# EAGLE design Stepper_driver_1_0 (EAGLE 6.6.0)
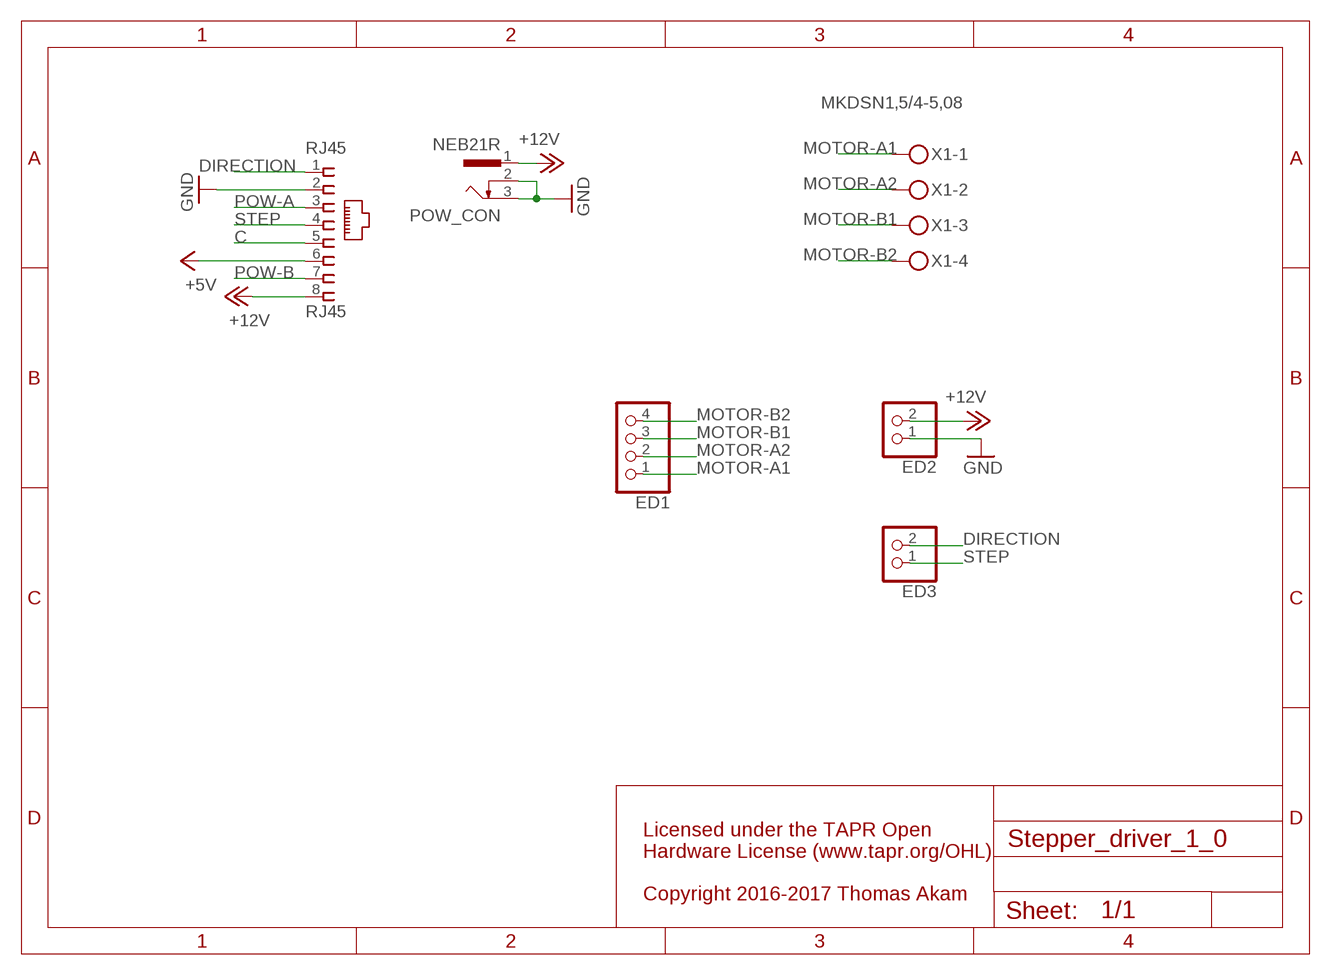
[diagram p0: schematic, sheet 1]

## Parts
ED1  PINHD-1X4  [1X04]
ED2  PINHD-1X2  [1X02]
ED3  PINHD-1X2  [1X02]
POW_CON  NEB21R  [NEB21R]
RJ45  RJ45  RJ45VERTICAL  [RJ45-NO-SHIELD-VERTICAL]
X1  MKDSN1,5/4-5,08  [MKDSN1,5/4-5,08]

## Nets
+5V: RJ45.6
+12V: ED2.2 POW_CON.1 RJ45.8
C: RJ45.5
DIRECTION: ED3.2 RJ45.1
GND: ED2.1 POW_CON.2 POW_CON.3 RJ45.2
MOTOR-A1: ED1.1 X1.1
MOTOR-A2: ED1.2 X1.2
MOTOR-B1: ED1.3 X1.3
MOTOR-B2: ED1.4 X1.4
POW-A: RJ45.3
POW-B: RJ45.7
STEP: ED3.1 RJ45.4

## Notes on the sheet
- Licensed under the TAPR Open
  Hardware License (www.tapr.org/OHL)
  
  Copyright 2016-2017 Thomas Akam

## Library data of the parts
ED1 = pinhead:PINHD-1X4: PIN HEADER
ED2 ED3 = pinhead:PINHD-1X2: PIN HEADER
POW_CON = con-lumberg:NEB21R: Netzgeräte-Einbaukupplung abgewinkelte Ausführung mit Öffner Source: http://www.lumberg.com/Produkte/PDFs/NEB21R.pdf; MPN: NEB 21 R; OC_FARNELL: 1217037; OC_NEWARK: 97K6458
RJ45 = con-tycoelectronics-vertical_RJ45:RJ45: CORCOM Modular RJ Jacks No Shield Source: www.tycoelectronics.com .. ENG_DS_1654001_1099_RJ_L_0507.pdf
X1 = con-phoenix-508:MKDSN1,5/4-5,08: MKDSN 1,5/ 4-5,08 Printklemme Nennstrom: 13,5 A Nennspannung: 250 V Rastermaß: 5,08 mm Polzahl: 4 Anschlussart: Schraubanschluss Montage: Löten Anschlussrichtung Leiter/Platine: 0 ° Artikelnummer: 1729144 Source: http://eshop.phoenixcontact.com .. 1729144.pdf

## Board
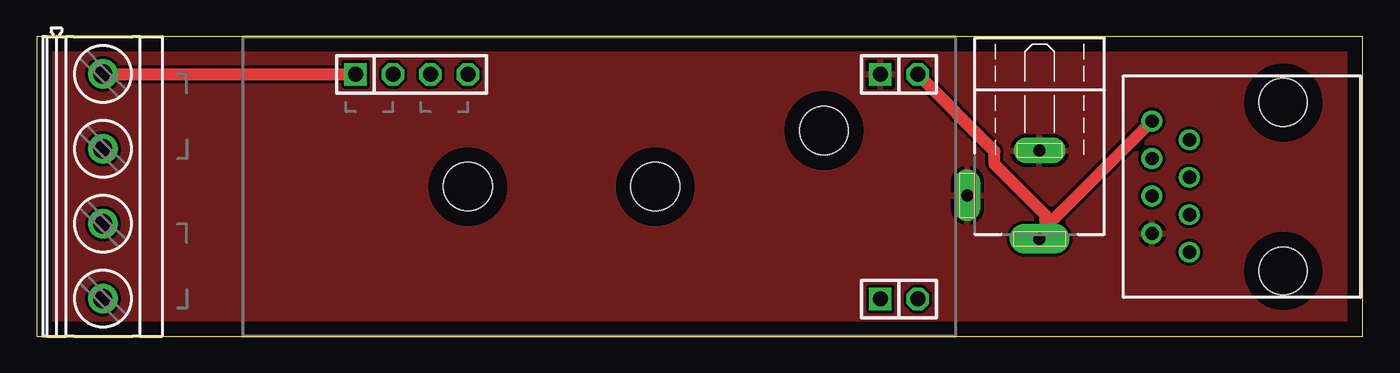
[diagram p1: board, top side]
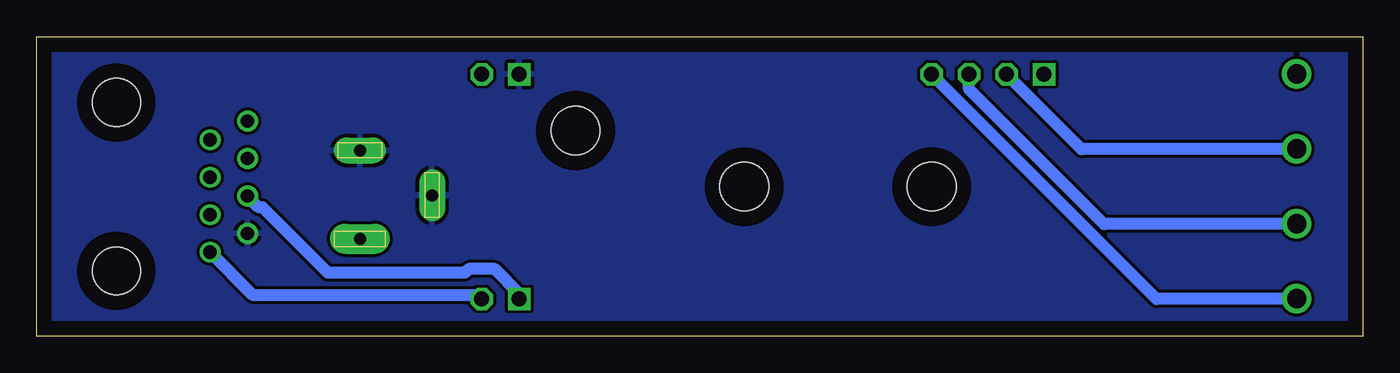
[diagram p2: board, bottom side, seen from below]

Size 89.84 x 20.3 mm. Coordinates in mm from the lower left corner, seen from the top.
Outline: 0,20.3 0,0 89.84,0 89.84,20.3 0,20.3
Copper layers (1*16): Top 0.035mm / dielectric 1.5mm / Bottom 0.035mm
Design rules "default *": minimum track width 32mil, minimum drill 24mil, track to track 8mil, track to pad 8mil, pad to pad 8mil, via to via 8mil, smd to smd 8mil, copper to edge 40mil, drill to drill 8mil, minimum pad ring 10mil, minimum via ring 8mil, stop-mask expansion 4mil, vias tented up to drill 0mil, thermal gap 10mil
Holes 3.3 mm at 29.21,10.14 53.34,13.95 41.91,10.14
vRestrict: area 15.9,1.9 to 34.3,5.1; area 20.3,12 to 30.5,16.5; area 55.9,3.8 to 61,16.5; area 7.6,0 to 14,20.3

### Footprints (pad centres in the part's own frame; a part is rotated, then mirrored left to right if it is on the bottom)
1X04 = drill 1.016 square: 1 -3.81,0 | drill 1.016 octagon: 2 -1.27,0; 3 1.27,0; 4 3.81,0
1X02 = drill 1.016 square: 1 -1.27,0 | drill 1.016 octagon: 2 1.27,0
NEB21R = drill 0.813 pad 2.032 long: 1 0,7.35 | drill 0.813 pad 1.778 long: 2 4.9,4.4; 3 0,1.35
RJ45-NO-SHIELD-VERTICAL = drill 0.9 pad 1.4: 1 -4.445,5.08; 2 -3.175,7.62; 3 -1.905,5.08; 4 -0.635,7.62; 5 0.635,5.08; 6 1.905,7.62; 7 3.175,5.08; 8 4.445,7.62 | hole 3.251: -5.715,-1.27; 5.715,-1.27
MKDSN1,5/4-5,08 = drill 1.3 pad 2: 1 -7.641,0.025; 2 -2.561,0.025; 3 2.519,0.025; 4 7.599,0.025

### Placement (x,y rotation side)
ED1  25.4,17.76 0 top
ED2  58.42,17.76 0 top
ED3  58.42,2.52 0 top
POW_CON  67.94,13.95 180 top
RJ45  83.19,10.14 90 top
X1  4.45,10.14 270 top

### Tracks (layer width: path | path; a pad name or v marks a point on that pad's centre or on a via)
+12V
  Top 0.813: 68.58,7.6 67.94,6.97 67.94,6.71 POW_CON.1 | 68.58,7.6 RJ45.8 | ED2.2 64.9,12.55 64.9,11.66 68.33,8.24 68.33,7.85 68.58,7.6
DIRECTION
  Bottom 0.813: RJ45.1 75.18,2.77 60.07,2.77 59.82,2.52 ED3.2
GND
  pour Bottom: 90.17,20.3 0,20.3 0,-0.02 90.17,-0.02
  pour Top: 0,20.3 90.17,20.3 89.53,-0.02 0,-0.02
MOTOR-A1
  Top 0.813: ED1.1 4.57,17.76 X1.1
MOTOR-A2
  Bottom 0.813: ED1.2 19.05,12.68 4.57,12.68 X1.2
MOTOR-B1
  Bottom 0.813: ED1.3 26.67,16.74 17.53,7.6 4.57,7.6 X1.3
MOTOR-B2
  Bottom 0.813: ED1.4 13.97,2.52 4.57,2.52 X1.4
STEP
  Bottom 0.813: RJ45.4 74.8,8.74 74.55,8.74 70.1,4.3 60.83,4.3 60.58,4.55 58.8,4.55 57.15,2.9 ED3.1

### Text on the board
Document: Licensed under the TAPR Open / Hardware License (www.tapr.org/OHL) / / Copyright 2018 Thomas Akam
tDocu: GND | +12V | A | A | B | MOTOR | MOTOR | B | STEP | DIR | EasyDriver